# EAGLE design v2 (EAGLE 8.7.0)

## Sheet 1 of 2
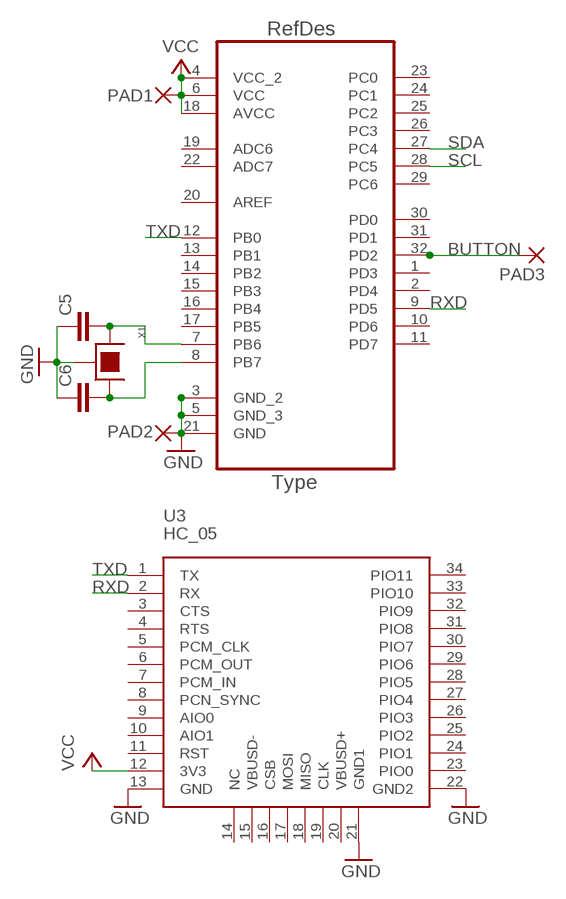
[diagram p0: schematic, sheet 1]

### Parts
C5  C-EUC0402  [C0402]
C6  C-EUC0402  [C0402]
PAD1  SMD2  [SMD1,27-2,54]
PAD2  SMD2  [SMD1,27-2,54]
PAD3  SMD2  [SMD1,27-2,54]
U2  ATMEGA328P-AU  [QFP80P900X900X120-32N]
U3  HC_05  [BLUETOOTH_SMD]
X1  SHIELDED_CRYSTAL_TSX-3225  [TSX-3225]

### Nets
BUTTON: PAD3.1(P) U2.32(PD2)
GND: C5.1 C6.1 PAD2.1(P) U2.3(GND_2) U2.5(GND_3) U2.21(GND) U3.13(GND) U3.21(GND1) U3.22(GND2) X1.2 X1.4 ; also sheet 2
N$1: C5.2 U2.7(PB6) X1.1
N$2: C6.2 U2.8(PB7) X1.3
RXD: U2.9(PD5) U3.2(RX)
SCL: U2.28(PC5) ; also sheet 2
SDA: U2.27(PC4) ; also sheet 2
TXD: U2.12(PB0) U3.1(TX)
VCC: PAD1.1(P) U2.4(VCC_2) U2.6(VCC) U2.18(AVCC) U3.12(3V3) ; also sheet 2
Unconnected: U2.1(PD3) U2.2(PD4) U2.10(PD6) U2.11(PD7) U2.13(PB1) U2.14(PB2) U2.15(PB3) U2.16(PB4) U2.17(PB5) U2.19(ADC6) U2.20(AREF) U2.22(ADC7) U2.23(PC0) U2.24(PC1) U2.25(PC2) U2.26(PC3) U2.29(PC6) U2.30(PD0) U2.31(PD1) U3.3(CTS) U3.4(RTS) U3.5(PCM_CLK) U3.6(PCM_OUT) U3.7(PCM_IN) U3.8(PCN_SYNC) U3.9(AIO0) U3.10(AIO1) U3.11(RST) U3.14(NC) U3.15(VBUSD-) U3.16(CSB) U3.17(MOSI) U3.18(MISO) U3.19(CLK) U3.20(VBUSD+) U3.23(PIO0) U3.24(PIO1) U3.25(PIO2) U3.26(PIO3) U3.27(PIO4) U3.28(PIO5) U3.29(PIO6) U3.30(PIO7) U3.31(PIO8) U3.32(PIO9) U3.33(PIO10) U3.34(PIO11)

## Sheet 2 of 2
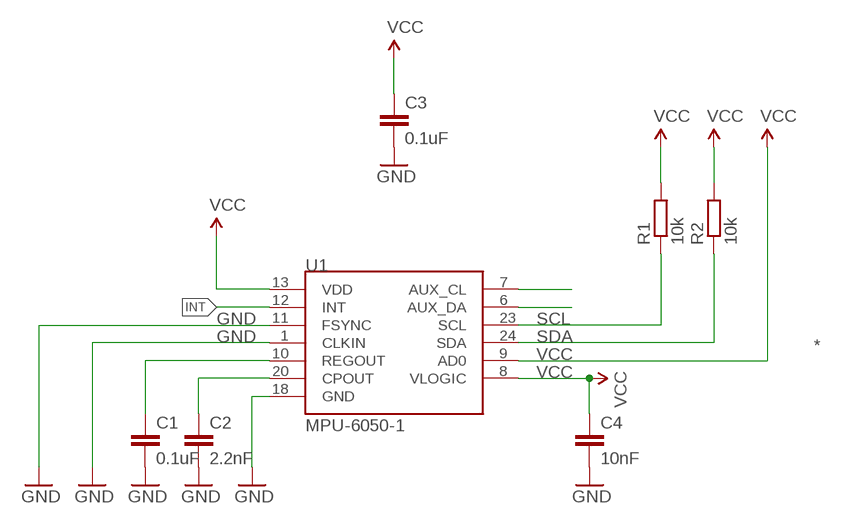
[diagram p1: schematic, sheet 2]

### Parts
C1  0.1uF  C-EUC0402  [C0402]
C2  2.2nF  C-EUC0402  [C0402]
C3  0.1uF  C-EUC0402  [C0402]
C4  10nF  C-EUC0402  [C0402]
R1  10k  R-EU_R0402  [R0402]
R2  10k  R-EU_R0402  [R0402]
U1  MPU-6050-1  [QFN-24-4MM2]

### Nets
AUX_SCL: U1.7(AUX_CL)
AUX_SDA: U1.6(AUX_DA)
GND: C1.2 C2.2 C3.2 C4.2 U1.1(CLKIN) U1.11(FSYNC) U1.18(GND) ; also sheet 1
INT: U1.12(INT)
N$3: C2.1 U1.20(CPOUT)
N$5: C1.1 U1.10(REGOUT)
SCL: R1.1 U1.23(SCL) ; also sheet 1
SDA: R2.1 U1.24(SDA) ; also sheet 1
VCC: C3.1 C4.1 R1.2 R2.2 U1.8(VLOGIC) U1.9(AD0) U1.13(VDD) ; also sheet 1

### Notes on the sheet
- *

## Library data of the parts
C1-C6 = rcl:C-EU: CAPACITOR, European symbol
PAD1-PAD3 = wirepad:SMD2: SMD PAD
R1 R2 = rcl:R-EU_: RESISTOR, European symbol
U1 = Testing:MPU-6050
U2 = Atmel-ATMEGA328P-AU:ATMEGA328P-AU; DESCRIPTION: 8-bit Microcontroller with In-System Programmable Flash; MPN: ATMEGA328P-AU; OC_FARNELL: 1715486; OC_NEWARK: 14R4631; PACKAGE: TQFP-32; SUPPLIER: Atmel
U3 = Bluetooth HC-05:HC_05: HC-05 Bluetooth Module
X1 = PP_FreqCtrl:SHIELDED_CRYSTAL

## Net classes
0 Default: width 0.203 mm

## Board
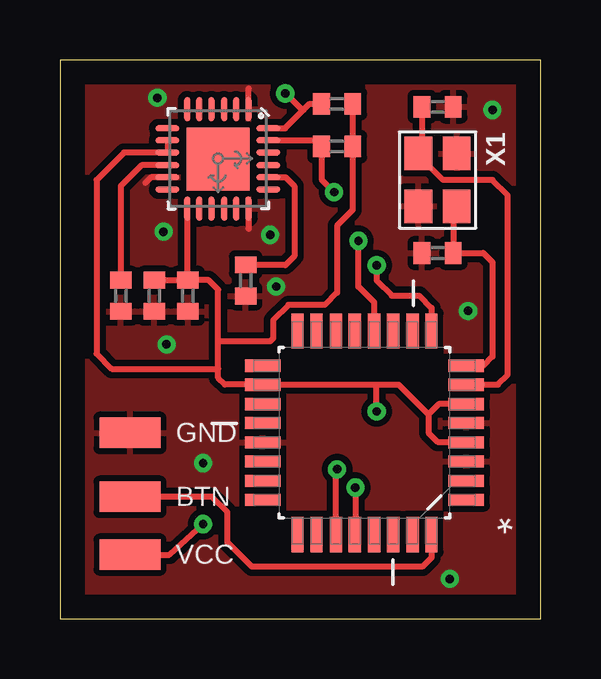
[diagram p2: board, top side]
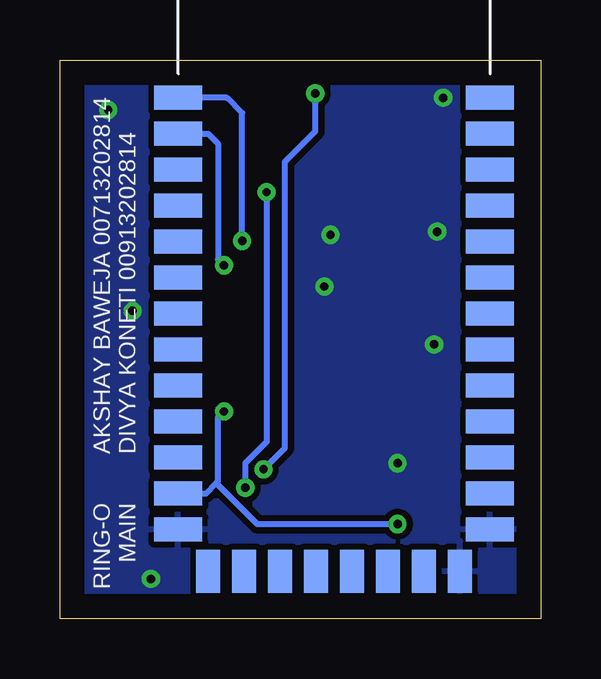
[diagram p3: board, bottom side, seen from below]

Size 20.05 x 23.29 mm. Coordinates in mm from the lower left corner, seen from the top.
Outline: 0,0 20.05,0 20.05,23.29 0,23.29 0,0
Copper layers (1*16): Top 0.035mm / dielectric 1.5mm / Bottom 0.035mm
Design rules "default *": minimum track width 6mil, minimum drill 0.35mm, track to track 6mil, track to pad 6mil, pad to pad 6mil, via to via 6mil, smd to smd 6mil, copper to edge 40mil, drill to drill 6mil, minimum pad ring 10mil, minimum via ring 8mil, stop-mask expansion 4mil, vias tented up to drill 0.35mm, thermal gap 10mil

### Footprints (pad centres in the part's own frame; a part is rotated, then mirrored left to right if it is on the bottom)
C0402 = smd 0.7 x 0.9: 1 -0.65,0; 2 0.65,0
SMD1,27-2,54 = smd 1.27 x 2.54: 1 0,0
R0402 = smd 0.7 x 0.9: 1 -0.65,0; 2 0.65,0
QFN-24-4MM2 = smd 1.016 x 0.254: 1 -2.066,1.257; 2 -2.066,0.75; 3 -2.066,0.247; 4 -2.066,-0.287; 5 -2.066,-0.792; 6 -2.066,-1.297; 13 2.086,-1.297; 14 2.086,-0.792; 15 2.086,-0.287; 16 2.086,0.247; 17 2.086,0.75; 18 2.086,1.257 | smd 0.254 x 1.016: 7 -1.267,-2.122; 8 -0.762,-2.122; 9 -0.258,-2.122; 10 0.278,-2.122; 11 0.78,-2.122; 12 1.287,-2.122; 19 1.287,2.082; 20 0.78,2.082; 21 0.278,2.082; 22 -0.258,2.082; 23 -0.762,2.082; 24 -1.267,2.082 | smd 2.616 x 2.616: P$1 0.02,-0.01
QFP80P900X900X120-32N = smd 1.473 x 0.508: 1 -4.242,2.794; 2 -4.242,2.007; 3 -4.242,1.194; 4 -4.242,0.406; 5 -4.242,-0.406; 6 -4.242,-1.194; 7 -4.242,-2.007; 8 -4.242,-2.794; 17 4.242,-2.794; 18 4.242,-2.007; 19 4.242,-1.194; 20 4.242,-0.406; 21 4.242,0.406; 22 4.242,1.194; 23 4.242,2.007; 24 4.242,2.794 | smd 0.508 x 1.473: 9 -2.794,-4.242; 10 -2.007,-4.242; 11 -1.194,-4.242; 12 -0.406,-4.242; 13 0.406,-4.242; 14 1.194,-4.242; 15 2.007,-4.242; 16 2.794,-4.242; 25 2.794,4.242; 26 2.007,4.242; 27 1.194,4.242; 28 0.406,4.242; 29 -0.406,4.242; 30 -1.194,4.242; 31 -2.007,4.242; 32 -2.794,4.242
BLUETOOTH_SMD = smd 2 x 1: 1 -6.35,3.81; 2 -6.35,2.31; 3 -6.35,0.81; 4 -6.35,-0.69; 5 -6.35,-2.19; 6 -6.35,-3.69; 7 -6.35,-5.19; 8 -6.35,-6.69; 9 -6.35,-8.19; 10 -6.35,-9.69; 11 -6.35,-11.19; 12 -6.35,-12.69; 13 -6.35,-14.19; 22 6.65,-14.19; 23 6.65,-12.69; 24 6.65,-11.19; 25 6.65,-9.69; 26 6.65,-8.19; 27 6.65,-6.69; 28 6.65,-5.19; 29 6.65,-3.69; 30 6.65,-2.19; 31 6.65,-0.69; 32 6.65,0.81; 33 6.65,2.31; 34 6.65,3.81 | smd 1 x 1.8: 14 -5.1,-15.94; 15 -3.6,-15.94; 16 -2.1,-15.94; 17 -0.6,-15.94; 18 0.9,-15.94; 19 2.4,-15.94; 20 3.9,-15.94; 21 5.4,-15.94
TSX-3225 = smd 1.4 x 1.15: 1 -1.1,-0.8; 2 1.1,-0.8; 3 1.1,0.8; 4 -1.1,0.8

### Placement (x,y rotation side)
C1  2.54,13.46 270 top
C2  7.75,14.1 270 top
C3  3.94,13.46 270 top
C4  5.33,13.46 270 top
C5  15.75,21.34 180 top
C6  15.75,15.24 0 top
PAD1  2.92,2.67 90 top
PAD2  2.92,7.75 90 top
PAD3  2.92,5.08 90 top
R1  11.56,19.68 0 top
R2  11.56,21.46 0 top
U1  6.6,19.18 270 top
U2  12.7,7.75 180 top
U3  8.76,17.91 0 bottom
X1  15.75,18.29 270 top

### Tracks (layer width: path | path; a pad name or v marks a point on that pad's centre or on a via)
BUTTON
  Top 0.254: PAD3.1 6.35,5.08 6.99,4.45 6.99,3.17 8,2.16 15.11,2.16 15.49,2.54 U2.32
GND  (via drill 0.35 pad 0.55)
  Top 0.254: U1.11 3.79,18.4 3.56,18.16 | U1.18 7.86,16.27 7.87,16.26 | U1.1 7.86,22.09 7.87,22.1
  other vias: 8.76,16 5.97,6.48 9.02,13.84 16.26,1.65 17.02,12.83 4.32,16.13 4.45,11.43 18.03,21.21 4.06,21.72
  pour Top (isolate 0.254): 0,24.13 20.32,24.13 20.32,0 0,0
  pour Bottom (isolate 0.254): 0,25.4 20.32,25.4 20.32,0 0,0
N$1
  Top 0.254: C5.2 15.1,19.54 X1.1 14.95,19.32 15.98,18.29 18.03,18.29 18.67,17.65 18.67,10.16 18.26,9.75 U2.7
N$2
  Top 0.254: X1.3 16.4,17.04 C6.2 17.65,15.24 18.03,14.86 18.03,10.92 17.65,10.54 U2.8
N$3
  Top 0.254: U1.20 9.42,18.4 9.78,18.03 9.78,15.11 9.4,14.73 9.38,14.75 C2.1
N$5
  Top 0.254: U1.10 3.4,18.9 2.54,18.03 C1.1
RXD  (via drill 0.35 pad 0.55)
  Top 0.254: v13.21,14.73 13.21,14.1 13.84,13.46 14.99,13.46 15.49,12.95 U2.9
  Bottom 0.254: U3.2 13.87,20.22 13.46,19.81 13.46,14.99 v13.21,14.73
SCL  (via drill 0.35 pad 0.55)
  Top 0.254: U1.23 10.65,19.94 R1.1 10.91,18.3 v11.43,17.78 | v12.32,5.46 12.32,3.53 U2.28
  Bottom 0.254: v11.43,17.78 11.43,7.37 12.32,6.48 v12.32,5.46
SDA  (via drill 0.35 pad 0.55)
  Top 0.254: U1.24 9.39,20.44 10.16,21.21 | R2.1 10.41,21.46 10.16,21.21 | U2.27 11.51,6.17 v11.56,6.22 | v9.4,21.9 10.09,21.21 10.16,21.21
  Bottom 0.254: v11.56,6.22 10.67,7.11 10.67,19.05 9.4,20.32 v9.4,21.9
TXD  (via drill 0.35 pad 0.55)
  Top 0.254: U2.12 13.11,13.18 12.45,13.84 v12.45,15.75
  Bottom 0.254: v12.45,15.75 12.45,21.08 13.08,21.72 U3.1
VCC  (via drill 0.35 pad 0.55)
  Top 0.254: U1.13 5.31,14.27 5.28,14.17 | 5.28,14.17 C4.1 6.21,14.11 6.6,13.72 6.6,11.56 | C3.1 5.22,14.11 5.28,14.17 | U1.8 U1.9 2.67,19.43 1.52,18.29 1.52,11.05 2.16,10.41 6.6,10.41 | U2.6 15.8,8.94 15.37,8.51 | 15.37,8.51 15.37,7.75 15.75,7.37 16.92,7.37 U2.4 | 13.21,9.75 U2.18 6.88,9.75 6.6,10.03 6.6,10.41 | 13.21,9.75 14.12,9.75 15.37,8.51 | 6.6,10.41 6.6,11.56 | v13.21,8.64 13.21,9.75 | PAD1.1 4.57,2.67 v5.97,3.94 | R1.2 R2.2 12.21,17.03 11.56,16.38 11.56,13.59 11.05,13.08 9.53,13.08 8.89,12.45 8.89,11.68 8.76,11.56 6.6,11.56
  Bottom 0.254: U3.12 13.96,5.22 13.53,5.65 | 13.53,5.65 13.46,5.71 13.46,8.38 v13.21,8.64 | v5.97,3.94 11.81,3.94 13.53,5.65

### Text on the board
tNames: GND | BTN | VCC
bNames: AKSHAY BAWEJA 00713202814 / DIVYA KONETI 00913202814 | RING-O / MAIN